# Altium project Relay HW-482 Module.PrjPcb
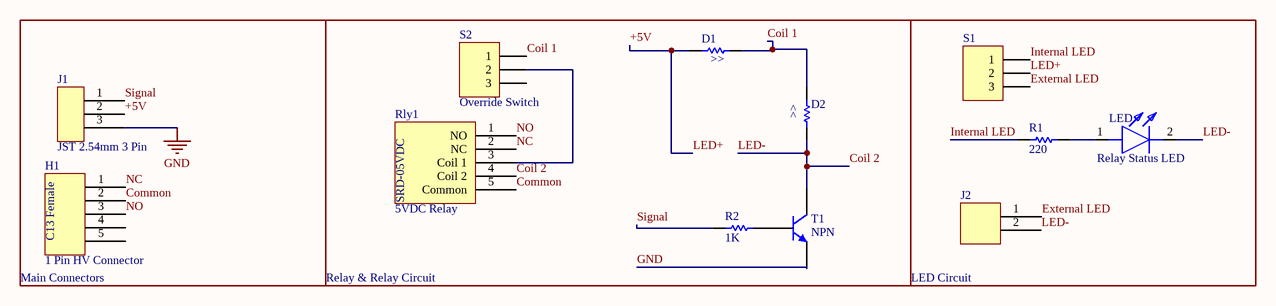
[diagram p0: main.SchDoc]
1 sheet, 12 parts. Net scope: global (net labels, ports and power ports of the same name join across sheets).
Board file: main.PcbDoc

## Sheet main.SchDoc
size Letter; SheetNumber: 1; SheetTotal: 1

### Parts
D1  Diode  [AXIAL-0.3]  (value not drawn)
D2  Diode  [AXIAL-0.3]  (value not drawn)
H1  1 Pin HV Connector  [C13 Female Plug]
J1  JST 2.54mm 3 Pin  [JST 2.54mm 3 pin]
J2  Component_1  [JST 2 pin 2.54mm]  (value not drawn)
LED  (no value)  [C5SMFRJECT0W0BB2]
R1  value 220  [AXIAL-0.3]  (hidden comment: Res1)
R2  value 1K  [AXIAL-0.3]  (hidden comment: Res1)
Rly1  5VDC Relay  [SRD-05VDC Relay]
S1  Header 3  [HDR1X3]  (value not drawn)
S2  Override Switch  [HDR1X3]
T1  NPN  [TO-226-AA]

### Blocks framed on the sheet
Main Connectors: H1 J1

### Nets
GND: J1.3 T1.3(E)
+5V: D1.2 J1.2 S1.2  [also labelled LED+]
Coil 1: D1.1 D2.2 S2.1
Coil 2: D2.1 J2.2 LED.2(K) Rly1.4(Coil_2) T1.1(C)  [also labelled LED-]
Common: H1.2 Rly1.5(Common)
External LED: J2.1 S1.3
Internal LED: R1.2 S1.1
NC: H1.1 Rly1.2(NC)
NO: H1.3 Rly1.1(NO)
Signal: J1.1 R2.2
NetLED_1: LED.1(A) R1.1
NetR2_1: R2.1 T1.2(B)
NetRly1_3: Rly1.3(Coil_1) S2.2

Not connected (* = marked no-connect by the designer): H1 4 5; S2 3

### Notes on the sheet
- (near D1) >>
- (near D2) >>
- (near LED) Relay Status LED
- Relay & Relay Circuit
- (near J2) LED Circuit
- (in symbol 1 Pin HV Connector) C13 Female
- (in symbol 5VDC Relay) SRD-05VDC

### Library data of the parts
D1 D2 = Res1: Resistor; Value: 0; Published: 8-Jun-2000; LatestRevisionDate: 17-Jul-2002; LatestRevisionNote: Re-released for DXP Platform.; PackageReference: AXIAL-0.3; Publisher: Altium Limited; PackageDescription: Axial Device, Thru-Hole; 2 Leads; 0.3 in Pin Spacing
H1 = 1 Pin HV Connector: Through-hole pad for soldering a high voltage wire
LED = C5SMF-RJE-CT0W0BB2: LED; Manufacturer_Name: Wolfspeed; Datasheet Link: https://www.mouser.com/datasheet/2/723/C5SMF_RJF_RJE_GJF_GJE_BJF_BJE_1240-2256911.pdf; Height: 8.75mm; Manufacturer_Part_Number: C5SMF-RJE-CT0W0BB2; Mouser Part Number: 941-C5SMFRJECT0W0BB2; Mouser Price/Stock: https://www.mouser.co.uk/ProductDetail/Cree-LED/C5SMF-RJE-CT0W0BB2?qs=1sbE9T7hb3bz%2FXMFB8lsHw%3D%3D; Arrow Part Number: C5SMF-RJE-CT0W0BB2; Arrow Price/Stock: https://www.arrow.com/en/products/c5smf-rje-ct0w0bb2/cree-led?region=nac
R1 R2 = Res1: Resistor; Published: 8-Jun-2000; LatestRevisionDate: 17-Jul-2002; LatestRevisionNote: Re-released for DXP Platform.; PackageReference: AXIAL-0.3; Publisher: Altium Limited; PackageDescription: Axial Device, Thru-Hole; 2 Leads; 0.3 in Pin Spacing
Rly1 = 5VDC Relay: https://www.amazon.com/MiZOELEC-SRD-05VDC-SL-C-Household-Appliance-Arduino/dp/B09J23B9WJ/ref=sr_1_1_sspa?keywords=srd-05vdc-sl-c&qid=1693356713&sr=8-1-spons&sp_csd=d2lkZ2V0TmFtZT1zcF9hdGY&psc=1
S1 S2 = Header 3: Header, 3-Pin; LatestRevisionDate: 17-Jul-2002; LatestRevisionNote: Re-released for DXP Platform.; Publisher: Altium Limited
T1 = NPN: NPN Bipolar Transistor; Published: 8-Jun-2000; LatestRevisionDate: 17-Jul-2002; LatestRevisionNote: Re-released for DXP Platform.; PackageReference: TO-226-AA; Publisher: Altium Limited; PackageDescription: TO, Flat Index; 3 In-Line, Axial Leads; Body Dia. 4.8mm; Leads 0.55 x 0.51 mm (max); Code_JEDEC: TO-226-AA